# EAGLE schematic mainboard (EAGLE 9.6.2)
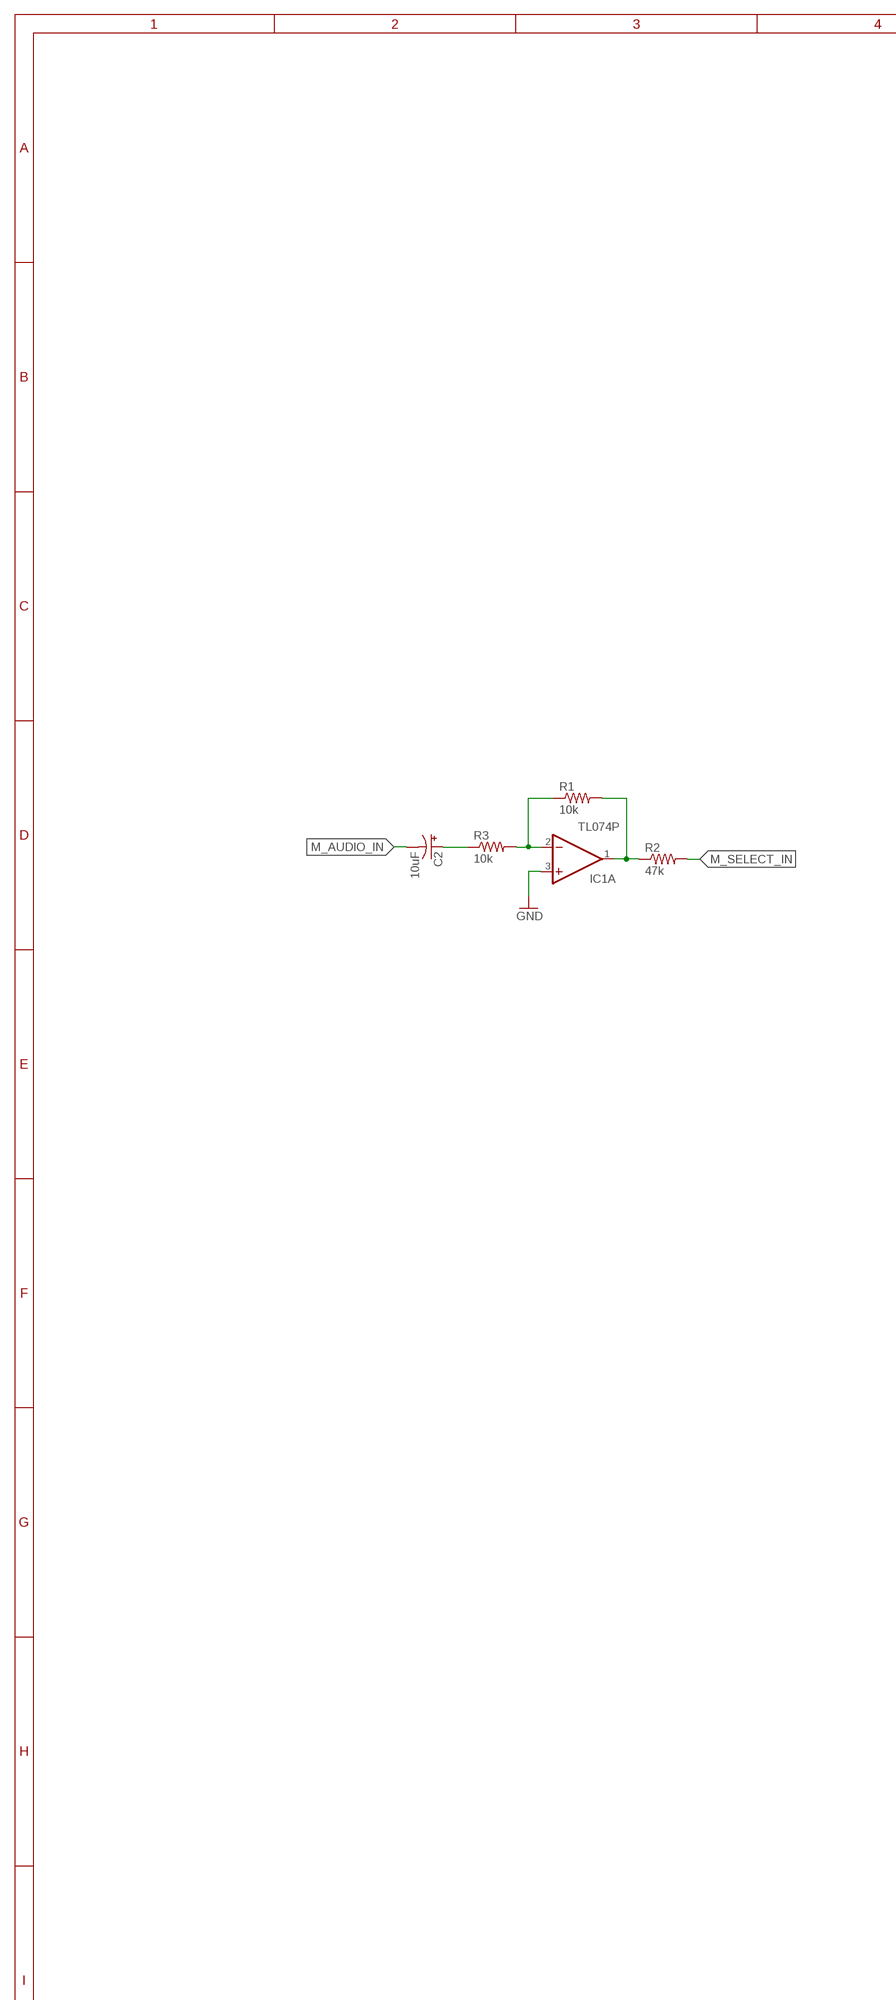
[diagram p0: schematic, sheet 1, part 1 of 2]
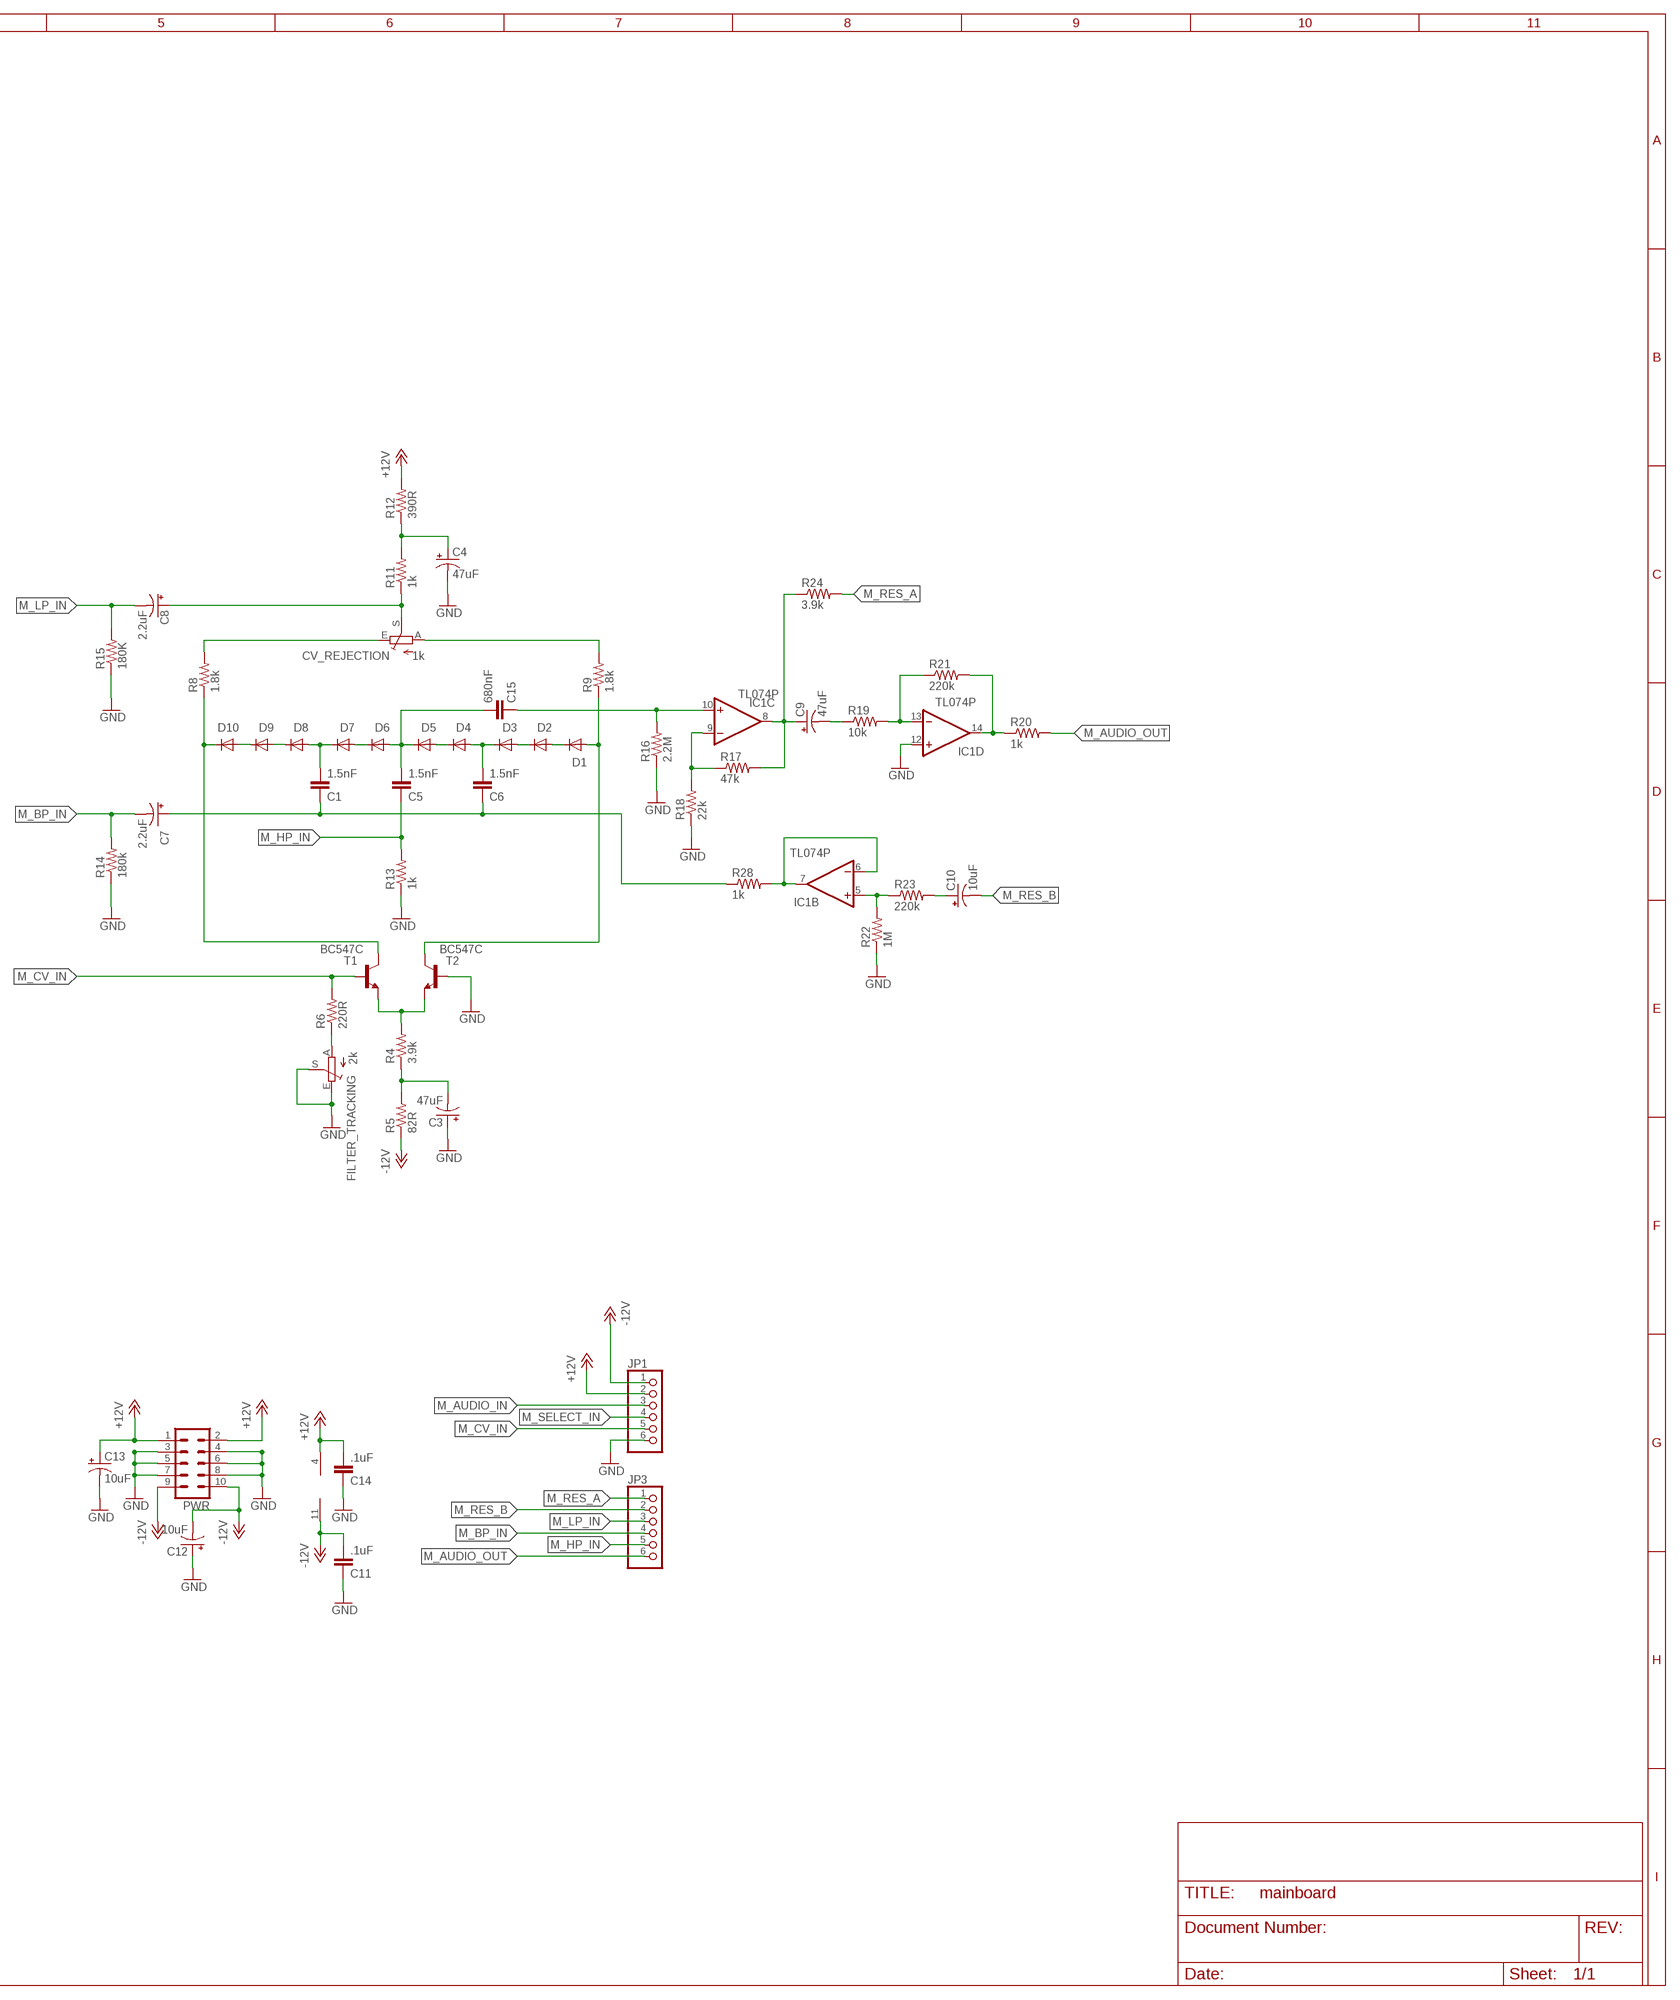
[diagram p1: schematic, sheet 1, part 2 of 2]

## Parts
C1  1.5nF  C-EU050-024X044  [C050-024X044]
C2  10uF  CPOL-USE2.5-5  [E2,5-5]
C3  47uF  CPOL-USE2.5-5  [E2,5-5]
C4  47uF  CPOL-USE2.5-5  [E2,5-5]
C5  1.5nF  C-EU050-024X044  [C050-024X044]
C6  1.5nF  C-EU050-024X044  [C050-024X044]
C7  2.2uF  CPOL-USE2.5-5  [E2,5-5]
C8  2.2uF  CPOL-USE2.5-5  [E2,5-5]
C9  47uF  CPOL-USE2.5-5  [E2,5-5]
C10  10uF  CPOL-USE2.5-5  [E2,5-5]
C11  .1uF  C-EU050-024X044  [C050-024X044]
C12  10uF  CPOL-USE2.5-5  [E2,5-5]
C13  10uF  CPOL-USE2.5-5  [E2,5-5]
C14  .1uF  C-EU050-024X044  [C050-024X044]
C15  680nF  C-EU050-035X075  [C050-035X075]
CV_REJECTION  1k  TRIM_1234-S64YW  [S64YW]
D1  1N4148DO35-7  [DO35-7]
D2  1N4148DO35-7  [DO35-7]
D3  1N4148DO35-7  [DO35-7]
D4  1N4148DO35-7  [DO35-7]
D5  1N4148DO35-7  [DO35-7]
D6  1N4148DO35-7  [DO35-7]
D7  1N4148DO35-7  [DO35-7]
D8  1N4148DO35-7  [DO35-7]
D9  1N4148DO35-7  [DO35-7]
D10  1N4148DO35-7  [DO35-7]
FILTER_TRACKING  2k  TRIM_1234-S64YW  [S64YW]
IC1  TL074P  [DIL14]
JP1  PINHD-1X6  [1X06]
JP3  PINHD-1X6  [1X06]
PWR  ML10  [ML10]
R1  10k  R-US_0204/7  [0204/7]
R2  47k  R-US_0204/7  [0204/7]
R3  10k  R-US_0204/7  [0204/7]
R4  3.9k  R-US_0204/7  [0204/7]
R5  82R  R-US_0204/7  [0204/7]
R6  220R  R-US_0204/7  [0204/7]
R8  1.8k  R-US_0204/7  [0204/7]
R9  1.8k  R-US_0204/7  [0204/7]
R11  1k  R-US_0204/7  [0204/7]
R12  390R  R-US_0204/7  [0204/7]
R13  1k  R-US_0204/7  [0204/7]
R14  180k  R-US_0204/7  [0204/7]
R15  180K  R-US_0204/7  [0204/7]
R16  2.2M  R-US_0204/7  [0204/7]
R17  47k  R-US_0204/7  [0204/7]
R18  22k  R-US_0204/7  [0204/7]
R19  10k  R-US_0204/7  [0204/7]
R20  1k  R-US_0204/7  [0204/7]
R21  220k  R-US_0204/7  [0204/7]
R22  1M  R-US_0204/7  [0204/7]
R23  220k  R-US_0204/7  [0204/7]
R24  3.9k  R-US_0204/7  [0204/7]
R28  1k  R-US_0204/7  [0204/7]
T1  BC547C  BC547-NPN-TO92-CBE  [TO92-CBE]
T2  BC547C  BC547-NPN-TO92-CBE  [TO92-CBE]

## Nets
+12V: C13.+ C14.1 IC1.4(P:V+) JP1.2 PWR.1 PWR.2 R12.2
-12V: C11.1 C12.- IC1.11(P:V-) JP1.1 PWR.9 PWR.10 R5.1
GND: C3.+ C4.- C11.2 C12.+ C13.- C14.2 FILTER_TRACKING.E FILTER_TRACKING.S IC1.3(A:+IN) IC1.12(D:+IN) JP1.6 PWR.3 PWR.4 PWR.5 PWR.6 PWR.7 PWR.8 R13.1 R14.1 R15.1 R16.1 R18.1 R22.1 T2.B
M_AUDIO_IN: C2.- JP1.3
M_AUDIO_OUT: JP3.6 R20.2
M_BP_IN: C7.- JP3.4 R14.2
M_CV_IN: JP1.5 R6.2 T1.B
M_HP_IN: C5.2 JP3.5 R13.2
M_LP_IN: C8.- JP3.3 R15.2
M_RES_A: JP3.1 R24.2
M_RES_B: C10.- JP3.2
M_SELECT_IN: JP1.4 R2.2
N$1: C2.+ R3.1
N$2: IC1.2(A:-IN) R1.1 R3.2
N$3: IC1.1(A:OUT) R1.2 R2.1
N$4: C3.- R4.1 R5.2
N$5: R4.2 T1.E T2.E
N$6: D1.A R9.1 T2.C
N$7: FILTER_TRACKING.A R6.1
N$8: D10.C R8.1 T1.C
N$9: D9.C D10.A
N$10: D8.C D9.A
N$11: C1.1 D7.C D8.A
N$12: D6.C D7.A
N$13: C15.2 IC1.10(C:+IN) R16.2
N$14: D4.C D5.A
N$15: C6.1 D3.C D4.A
N$16: D2.C D3.A
N$17: D1.C D2.A
N$18: CV_REJECTION.E R8.2
N$19: CV_REJECTION.A R9.2
N$20: C8.+ CV_REJECTION.S R11.1
N$21: C4.+ R11.2 R12.1
N$22: C1.2 C6.2 C7.+ R28.1
N$23: IC1.9(C:-IN) R17.1 R18.2
N$24: C9.+ IC1.8(C:OUT) R17.2 R24.1
N$25: IC1.13(D:-IN) R19.2 R21.1
N$26: C9.- R19.1
N$27: IC1.5(B:+IN) R22.2 R23.1
N$28: IC1.14(D:OUT) R20.1 R21.2
N$29: C10.+ R23.2
N$30: IC1.6(B:-IN) IC1.7(B:OUT) R28.2
N$35: C5.1 C15.1 D5.C D6.A
Unconnected: CV_REJECTION.S@1(S) FILTER_TRACKING.S@1(S)

## Library data of the parts
C1 C5 C6 C11 C14 C15 = resistor:C-EU: CAPACITOR, European symbol
C2-C4 C7-C10 C12 C13 = resistor:CPOL-US: POLARIZED CAPACITOR, American symbol
CV_REJECTION FILTER_TRACKING = pot:TRIM_1234-: POTENTIOMETER
D1-D10 = diode:1N4148: DIODE high speed (Philips)
IC1 = linear:TL074: OP AMP
JP1 JP3 = pinhead:PINHD-1X6: PIN HEADER
PWR = con-ml:ML10: HARTING; OC_FARNELL: unknown; OC_NEWARK: unknown
R1-R6 R8 R9 R11-R24 R28 = resistor:R-US_: RESISTOR, American symbol
T1 T2 = transistor:*-NPN-: NPN Transistror BF959 corrected 2008.03.06